# Altium schematic sheet Lipo_Charger.SchDoc: USB_Charger
size A4; Author: Sajitha Madugalle; Revision: 1; SheetNumber: 3; SheetTotal: 9
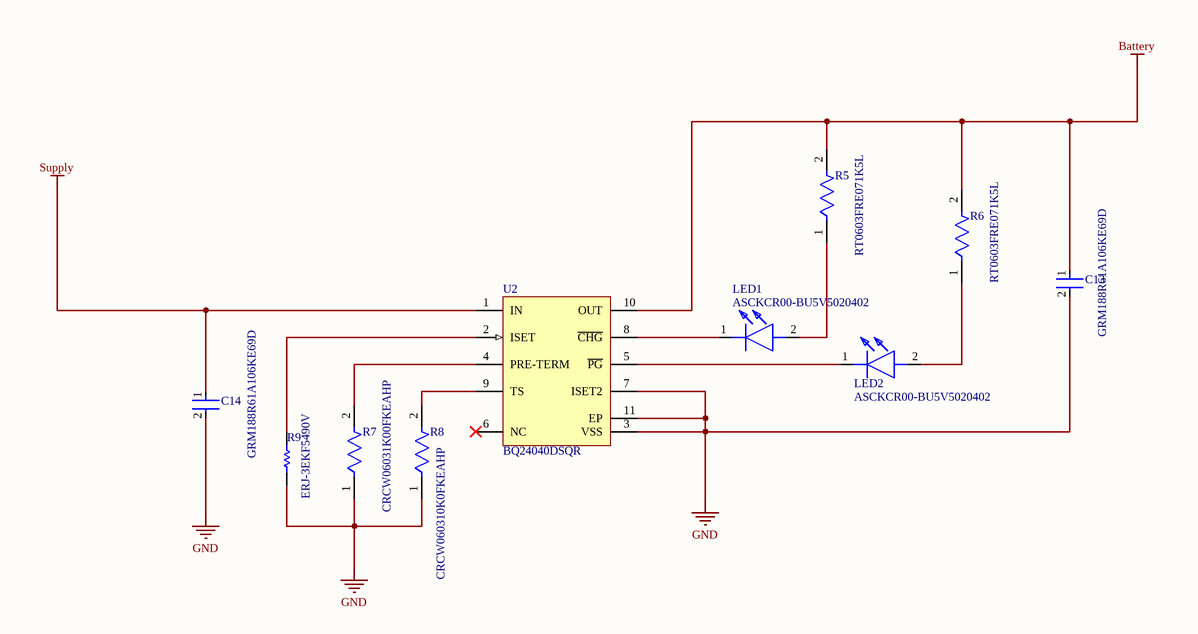
[diagram p0: Lipo_Charger.SchDoc]

## Parts
C13  GRM188R61A106KE69D  [FP-GRM18-0_15-MFG]
C14  GRM188R61A106KE69D  [FP-GRM18-0_15-MFG]
LED1  ASCKCR00-BU5V5020402  [ASCKCR00BU5V5020402]
LED2  ASCKCR00-BU5V5020402  [ASCKCR00BU5V5020402]
R5  RT0603FRE071K5L  [FP-RT0603-MFG]
R6  RT0603FRE071K5L  [FP-RT0603-MFG]
R7  CRCW06031K00FKEAHP  [FP-CRCW0603-HPe3-MFG]
R8  CRCW060310K0FKEAHP  [FP-CRCW0603-HPe3-MFG]
R9  ERJ-3EKF5490V  [RESC1608X55X30ML15T15]
U2  BQ24040DSQR  [DSQ0010A_V]

## Nets
Battery: C13.1 R5.2 R6.2 U2.10(OUT)
GND: C13.2 C14.2 R7.1 R8.1 R9.1 U2.3(VSS) U2.7(ISET2) U2.11(EP)
Supply: C14.1 U2.1(IN)
NetLED1_1: LED1.1(K) U2.8(~{CHG})
NetLED1_2: LED1.2(A) R5.1
NetLED2_1: LED2.1(K) U2.5(~{PG})
NetLED2_2: LED2.2(A) R6.1
NetR7_2: R7.2 U2.4(PRE-TERM)
NetR8_2: R8.2 U2.9(TS)
NetR9_2: R9.2 U2.2(ISET)

Not connected (* = marked no-connect by the designer): U2 6(NC)*

## Notes on the sheet
- Title:
- Size:
- Document Number :
- Revision
- Drawn by:
- Checked by:
- Date:
- A4
- Time:
- Aprooved by:
- Sheet:
- of
- File:

## Library data of the parts
C13 C14 = CMP-2000-05448-2: CAP CER 10UF 10V X5R 0603; Manufacturer: Murata; Temperature Coefficient: 15%; Material: Ceramic; Tolerance: 10%; Device Class L1: Passive Components; ComponentLink2Description: Datasheet; Height: 0.95mm; Package: GRM18-0.15; Octopart: https://octopart.com/grm188r61a106ke69d-murata-22851381; Manufacturer Part Number: GRM188R61A106KE69D; Value: 10uF; Digikey Description: CAP CER 10UF 10V X5R 0603; Temperature Range High: +85°C; Temperature Range Low: -55°C; Temperature Characteristic: X5R; Capacitance: 10uF; RoHS: TRUE; Device Class L2: Capacitors; ComponentLink2URL: https://search.murata.co.jp/Ceramy/image/img/A01X/G101/ENG/GRM188R61A106KE69-01A.pdf; Device Class L3: Ceramic Capacitors; Lead Free: Yes; Mouser Description: Multilayer Ceramic Capacitors MLCC - SMD/SMT 0603 10uF 10volts X5R + - 10%; Category: Cap; Voltage Rating: 10V; Temperature: -55°C to +85°C; Automotive: No
LED1 LED2 = ASCKCR00-BU5V5020402: LED; Manufacturer_Name: Avago Technologies; Datasheet Link: https://docs.broadcom.com/doc/ASCKCx00-xxxxx0x0x02-DS; Height: 0.75mm; Manufacturer_Part_Number: ASCKCR00-BU5V5020402; Mouser Part Number: 630-ASCKCR00BU5V5020; Mouser Price/Stock: https://www.mouser.co.uk/ProductDetail/Broadcom-Avago/ASCKCR00-BU5V5020402?qs=OcgtsXO%252B3gu355%2FiA8jcWA%3D%3D
R5 R6 = CMP-03412-003799-1: RES SMD 1.5K OHM 1% 1/10W 0603; Manufacturer: Yageo; Value: 1.5KΩ; Temperature Coefficient: 50 ppm/°C; Voltage Rating: 75V; Power Rating: 0.1W; Tolerance: 0.01; Lead Free: Yes; Composition: Thin Film; ComponentLink2Description: Datasheet; Device Class L3: Chip SMD Resistors; Octopart: https://octopart.com/rt0603fre071k5l-yageo-39862564; Device Class L1: Passive Components; Category: Res; Ipc Land Pattern Name: RESC16080X45; Automotive: No; Manufacturer Part Number: RT0603FRE071K5L; Resistance: 1.5KΩ; Temperature Range High: +155°C; Package: RT0603; Footprint Url: http://www.yageo.com/exep/pages/download/literatures/PYu-R_Mount_10.pdf; Series: RT; RoHS: TRUE; Mouser Description: Thin Film Resistors - SMD 1/10W 1.5K ohm 1% 50ppm; Temperature: -55°C to +155°C; ComponentLink2URL: http://www.yageo.com/documents/recent/PYu-RT_1-to-0.01_RoHS_L_9.pdf; Temperature Range Low: -55°C; Device Class L2: Resistors; Digikey Description: RES SMD 1.5K OHM 1% 1/10W 0603; Height: 0.55mm
R7 = CMP-2000-02970-2: RES Thick Film, 1kΩ, 1%, 0.33W, 100ppm/°C, 0603; Max Power Dissipation: 250mW; Voltage Rating (DC): 75V; Resistance: 1kR; Number of Terminations: 2; Min Operating Temperature: -55°C; Contact Plating: Tin; Termination: SMD/SMT; Weight: 7.1E-05oz; Height: 0.45mm; Radiation Hardening: No; Package Quantity: 10; Case Code (Imperial): 0603; Packaging: Tape and Reel; Max Operating Temperature: 155°C; Case/Package: 0603; Lead Free: Lead Free; Military Standard: Not; Mount: Surface Mount; Power Rating: 250mW; Length: 1.6mm; Features: Automotive AEC-Q200; Number of Pins: 2; Voltage Rating: 75V; Temperature Coefficient: 100ppm/°C; Depth: 0.85mm; Tolerance: 1%; Composition: Thick Film; Width: 0.8mm; Case Code (Metric): 1608
R8 = CMP-2000-03835-2: RES SMD 10K OHM 1% 1/3W 0603; Resistance: 10kR; Voltage Rating (DC): 75V; Max Power Dissipation: 250mW; Temperature Coefficient: 100ppm/°C; Case Code (Metric): 1608; Features: Automotive AEC-Q200; Termination: SMD/SMT; Number of Terminations: 2; Case Code (Imperial): 0603; Tolerance: 1%; Depth: 0.85mm; Package Quantity: 10; Length: 1.6mm; Packaging: Tape and Reel; Contact Plating: Tin; Radiation Hardening: No; Case/Package: 0603; Composition: Thick Film; Voltage Rating: 75V; Weight: 7.1E-05oz; Max Operating Temperature: 155°C; Lead Free: Lead Free; Width: 0.033inch; Power Rating: 250mW; Min Operating Temperature: -55°C; Military Standard: Not; Height: 0.45mm
R9 = CMP-2000-00559-1: Manufacturer: Panasonic; Part Number: ERJ-3EKF5490V
U2 = CMP-0321-00456-2: 800 mA, Single-Input, Single Cell Li-Ion Battery Charger with Auto Start. Vovp=6.6 V, 3.5 V, -40 to 85 degC, 10-pin SON (DSQ), Green (RoHS & no Sb/Br); Manufacturer: Texas Instruments; NiCd: N; Vin(Min)(V): 3.5; SubFamily: Battery Charge Management; PackageDescription: 10-Pin Plastic Small Outline No-Lead, 2 x 2 x 0.8 mm Body, 0.4 mm Pitch, Exposed Pad; PackageVersion: revB, Apr-2010; Mounting Technology: Surface Mount; Eco-Plan: Green (RoHS & no Sb/Br); ComponentLink1URL: http://www.ti.com/general/docs/lit/getliterature.tsp?genericPartNumber=BQ24040&fileType=pdf; PartNumber: BQ24040DSQR; DatasheetVersion: SLUS941A; Over Voltage Protection: N; PackageReference: DSQ0010A; NiMH: N; Li-Ion: N; Lead Acid: N; Li-Polymer: N; ComponentLink1Description: Datasheet